# Altium schematic sheet 10-DPLL-1.SchDoc
size B; SheetNumber: 10; SheetTotal: 25
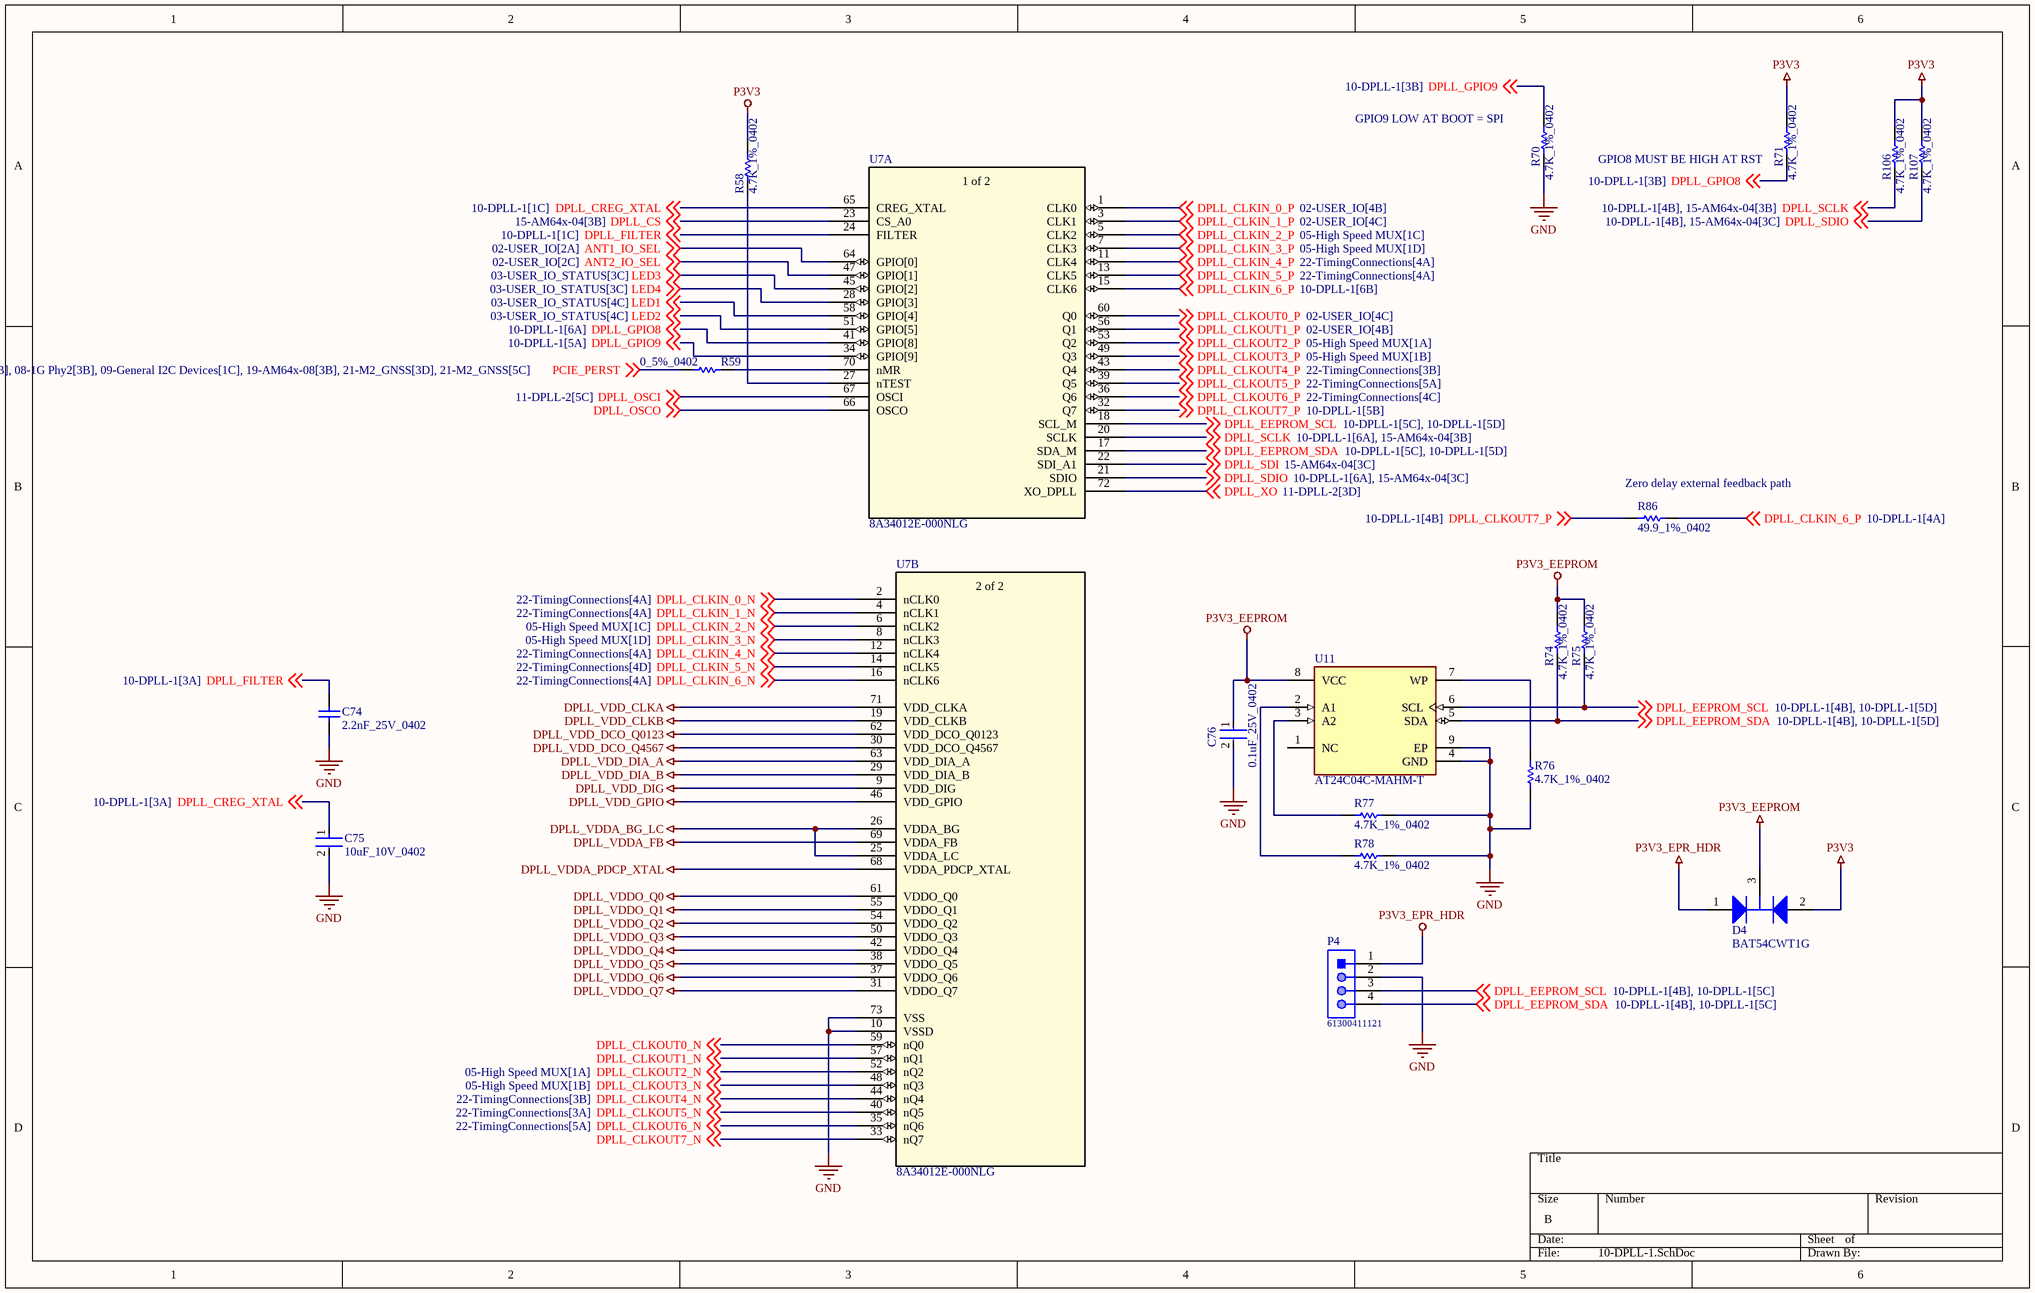
[diagram p0: 10-DPLL-1.SchDoc]

## Parts
C74  2.2nF_25V_0402  [CAPC1005X56X25LL10T15]
C75  10uF_10V_0402  [FP-CL05A106MP5NUNC-MFG]
C76  0.1uF_25V_0402  [FP-0402-L_1_0_1-W_0_5_0_1-IPC_C]
D4  BAT54CWT1G  [ONSC-SOT-323-3-419-04_V]
P4  61300411121  [61300411121]
R58  4.7K_1%_0402  [RESC1005X40X25NL10T10]
R59  0_5%_0402  [RESC1005X40X25LL10T10]
R70  4.7K_1%_0402  [RESC1005X40X25NL10T10]
R71  4.7K_1%_0402  [RESC1005X40X25NL10T10]
R74  4.7K_1%_0402  [RESC1005X40X25NL10T10]
R75  4.7K_1%_0402  [RESC1005X40X25NL10T10]
R76  4.7K_1%_0402  [RESC1005X40X25NL10T10]
R77  4.7K_1%_0402  [RESC1005X40X25NL10T10]
R78  4.7K_1%_0402  [RESC1005X40X25NL10T10]
R86  49.9_1%_0402  [RESC1005X40X25NL10T10]
R106  4.7K_1%_0402  [RESC1005X40X25NL10T10]
R107  4.7K_1%_0402  [RESC1005X40X25NL10T10]
U7  8A34012E-000NLG  [QFN_2E-000NLG_REN]  (parts A,B of 2)
U11  AT24C04C-MAHM-T  [FP-C04-21355-Q4B-IPC_B]

## Nets
DPLL_VDD_CLKA: U7.71(VDD_CLKA)
DPLL_VDD_CLKB: U7.19(VDD_CLKB)
DPLL_VDD_DCO_Q0123: U7.62(VDD_DCO_Q0123)
DPLL_VDD_DCO_Q4567: U7.30(VDD_DCO_Q4567)
DPLL_VDD_DIA_A: U7.63(VDD_DIA_A)
DPLL_VDD_DIA_B: U7.29(VDD_DIA_B)
DPLL_VDD_DIG: U7.9(VDD_DIG)
DPLL_VDD_GPIO: U7.46(VDD_GPIO)
DPLL_VDDA_BG_LC: U7.25(VDDA_LC) U7.26(VDDA_BG)
DPLL_VDDA_FB: U7.69(VDDA_FB)
DPLL_VDDA_PDCP_XTAL: U7.68(VDDA_PDCP_XTAL)
DPLL_VDDO_Q0: U7.61(VDDO_Q0)
DPLL_VDDO_Q1: U7.55(VDDO_Q1)
DPLL_VDDO_Q2: U7.54(VDDO_Q2)
DPLL_VDDO_Q3: U7.50(VDDO_Q3)
DPLL_VDDO_Q4: U7.42(VDDO_Q4)
DPLL_VDDO_Q5: U7.38(VDDO_Q5)
DPLL_VDDO_Q6: U7.37(VDDO_Q6)
DPLL_VDDO_Q7: U7.31(VDDO_Q7)
GND: C74.1 C75.2 C76.2 P4.2 R70.2 R76.2 R77.1 R78.2 U7.10(VSSD) U7.73(VSS) U11.4(GND) U11.9(EP)
P3V3: D4.2(A2) R58.2 R71.1 R106.1 R107.1
P3V3_EEPROM: C76.1 D4.3(K) R74.1 R75.1 U11.8(VCC)
P3V3_EPR_HDR: D4.1(A1) P4.1
ANT1_IO_SEL: U7.64(GPIO[0]) ; off-sheet ANT1_IO_SEL
ANT2_IO_SEL: U7.47(GPIO[1]) ; off-sheet ANT2_IO_SEL
DPLL_CLKIN_0_N: U7.2(nCLK0) ; off-sheet DPLL_CLKIN_0_N
DPLL_CLKIN_0_P: U7.1(CLK0) ; off-sheet DPLL_CLKIN_0_P
DPLL_CLKIN_1_N: U7.4(nCLK1) ; off-sheet DPLL_CLKIN_1_N
DPLL_CLKIN_1_P: U7.3(CLK1) ; off-sheet DPLL_CLKIN_1_P
DPLL_CLKIN_2_N: U7.6(nCLK2) ; off-sheet DPLL_CLKIN_2_N
DPLL_CLKIN_2_P: U7.5(CLK2) ; off-sheet DPLL_CLKIN_2_P
DPLL_CLKIN_3_N: U7.8(nCLK3) ; off-sheet DPLL_CLKIN_3_N
DPLL_CLKIN_3_P: U7.7(CLK3) ; off-sheet DPLL_CLKIN_3_P
DPLL_CLKIN_4_N: U7.12(nCLK4) ; off-sheet DPLL_CLKIN_4_N
DPLL_CLKIN_4_P: U7.11(CLK4) ; off-sheet DPLL_CLKIN_4_P
DPLL_CLKIN_5_N: U7.14(nCLK5) ; off-sheet DPLL_CLKIN_5_N
DPLL_CLKIN_5_P: U7.13(CLK5) ; off-sheet DPLL_CLKIN_5_P
DPLL_CLKIN_6_N: U7.16(nCLK6) ; off-sheet DPLL_CLKIN_6_N
DPLL_CLKIN_6_P: R86.2 U7.15(CLK6) ; off-sheet DPLL_CLKIN_6_P
DPLL_CLKOUT0_N: U7.59(nQ0) ; off-sheet DPLL_CLKOUT0_N
DPLL_CLKOUT0_P: U7.60(Q0) ; off-sheet DPLL_CLKOUT0_P
DPLL_CLKOUT1_N: U7.57(nQ1) ; off-sheet DPLL_CLKOUT1_N
DPLL_CLKOUT1_P: U7.56(Q1) ; off-sheet DPLL_CLKOUT1_P
DPLL_CLKOUT2_N: U7.52(nQ2) ; off-sheet DPLL_CLKOUT2_N
DPLL_CLKOUT2_P: U7.53(Q2) ; off-sheet DPLL_CLKOUT2_P
DPLL_CLKOUT3_N: U7.48(nQ3) ; off-sheet DPLL_CLKOUT3_N
DPLL_CLKOUT3_P: U7.49(Q3) ; off-sheet DPLL_CLKOUT3_P
DPLL_CLKOUT4_N: U7.44(nQ4) ; off-sheet DPLL_CLKOUT4_N
DPLL_CLKOUT4_P: U7.43(Q4) ; off-sheet DPLL_CLKOUT4_P
DPLL_CLKOUT5_N: U7.40(nQ5) ; off-sheet DPLL_CLKOUT5_N
DPLL_CLKOUT5_P: U7.39(Q5) ; off-sheet DPLL_CLKOUT5_P
DPLL_CLKOUT6_N: U7.35(nQ6) ; off-sheet DPLL_CLKOUT6_N
DPLL_CLKOUT6_P: U7.36(Q6) ; off-sheet DPLL_CLKOUT6_P
DPLL_CLKOUT7_N: U7.33(nQ7) ; off-sheet DPLL_CLKOUT7_N
DPLL_CLKOUT7_P: R86.1 U7.32(Q7) ; off-sheet DPLL_CLKOUT7_P
DPLL_CREG_XTAL: C75.1 U7.65(CREG_XTAL) ; off-sheet DPLL_CREG_XTAL
DPLL_CS: U7.23(CS_A0) ; off-sheet DPLL_CS
DPLL_EEPROM_SCL: P4.3 R75.2 U7.18(SCL_M) U11.6(SCL) ; off-sheet DPLL_EEPROM_SCL
DPLL_EEPROM_SDA: P4.4 R74.2 U7.17(SDA_M) U11.5(SDA) ; off-sheet DPLL_EEPROM_SDA
DPLL_FILTER: C74.2 U7.24(FILTER) ; off-sheet DPLL_FILTER
DPLL_GPIO8: R71.2 U7.41(GPIO[8]) ; off-sheet DPLL_GPIO8
DPLL_GPIO9: R70.1 U7.34(GPIO[9]) ; off-sheet DPLL_GPIO9
DPLL_OSCI: U7.67(OSCI) ; off-sheet DPLL_OSCI
DPLL_OSCO: U7.66(OSCO) ; off-sheet DPLL_OSCO
DPLL_SCLK: R106.2 U7.20(SCLK) ; off-sheet DPLL_SCLK
DPLL_SDI: U7.22(SDI_A1) ; off-sheet DPLL_SDI
DPLL_SDIO: R107.2 U7.21(SDIO) ; off-sheet DPLL_SDIO
DPLL_XO: U7.72(XO_DPLL) ; off-sheet DPLL_XO
LED1: U7.58(GPIO[4]) ; off-sheet LED1
LED2: U7.51(GPIO[5]) ; off-sheet LED2
LED3: U7.45(GPIO[2]) ; off-sheet LED3
LED4: U7.28(GPIO[3]) ; off-sheet LED4
PCIE_PERST: R59.1 ; off-sheet PCIE_PERST
NetR58_1: R58.1 U7.27(nTEST)
NetR59_2: R59.2 U7.70(nMR)
NetR76_1: R76.1 U11.7(WP)
NetR77_2: R77.2 U11.3(A2)
NetR78_1: R78.1 U11.2(A1)

Not connected (* = marked no-connect by the designer): U11 1(NC)

## Notes on the sheet
- (near R70) GPIO9 LOW AT BOOT = SPI
- GPIO8 MUST BE HIGH AT RST
- (near R86) Zero delay external feedback path
- (in symbol 8A34002E-000NLG, part A) 1 of 2
- (in symbol 8A34002E-000NLG, part B) 2 of 2

## Library data of the parts
C74 = CMP-2008-02907-1: Manufacturer: AVX Interconnect / Elco; Part Number: 04025C222JAT2A
C75 = CMP-13271-000002-1: CAP CER 10UF 10V X5R 0402; Manufacturer Part Number: CL05A106MP5NUNC; Manufacturer: Samsung; Temperature Coefficient: 15%; Tolerance: 20%; Material: Ceramic; Octopart: https://octopart.com/cl05a106mp5nunc-samsung-22457395; Voltage Rating: 10V; RoHS: TRUE; Value: 10uF; Height: 0.7mm; Digikey Description: CAP CER 10UF 10V X5R 0402; Automotive: No; Package: CL05A106MP5NUNC; Device Class L1: Passive Components; Capacitance: 10uF; Temperature Range High: +85°C; ComponentLink2Description: Datasheet; Device Class L2: Capacitors; Temperature Characteristic: X5R; Temperature: -55°C to +85°C; ComponentLink2URL: http://www.samsungsem.com/kr/support/product-search/mlcc/__icsFiles/afieldfile/2019/05/10/19-CL05A106MP5NUNC.pdf; Device Class L3: Ceramic Capacitors; Category: Cap; Temperature Range Low: -55°C; Ipc Land Pattern Name: CAPC10050X50; Lead Free: Yes
C76 = CMP-2008-02519-2: General Purpose Ceramic Capacitor, 0402, 100nF, 10%, X7R, 15%, 25V; Package Quantity: 1; Capacitance: 100nF; Min Operating Temperature: -55°C; Voltage: 25V; Voltage Rating: 25V; Construction: Flat; Max Operating Temperature: 125°C; Radiation Hardening: No; Depth: 0.5mm; Thickness: 0.022inch; Voltage Rating (DC): 25V; Number of Pins: 2; Lead Free: Lead Free; Series: -; REACH SVHC: No SVHC; Length: 1mm; Dielectric: X7R; RoHS Compliant: Yes; Mount: Surface Mount; Packaging: Tape and Reel; Case/Package: 0402; Case Code (Imperial): 0402; Termination: SMD/SMT; Width: 0.02inch; Case Code (Metric): 1005; Tolerance: 10%
D4 = CMP-1055-00557-1: Dual Series Cathode Schottky Barrier Diodes, 3-Pin SOT-323, Pb-Free, Tape and Reel; Manufacturer: On Semiconductor; Configuration: Common Cathode; IFSM Max (A): 0.6; trr Max (ns): 5; ComponentLink2Description: Datasheet; Packing: Tape and Reel; ComponentLink3Description: Package Specification; Mounting Technology: Surface Mount; PartNumber: BAT54CWT1G; PackageVersion: Rev. N, 11/2008; RoHS: TRUE; ComponentLink3URL: http://www.onsemi.com/pub_link/Collateral/419-04.PDF; ComponentLink2URL: http://www.onsemi.cn/pub_link/Collateral/BAT54CWT1-D.PDF; PackageReference: SOT-323-3-419-04; ComponentLink1URL: http://www.onsemi.com/; ComponentLink1Description: Manufacturer URL; DatasheetVersion: Rev. 7; PackageDescription: 3-Pin Small Outline Transistor, Body 2 x 1.25 mm, Pitch 0.65 mm
P4 = CMP-1502-01064-1: THT Vertical Pin Header WR-PHD, Pitch 2.54 mm, Single Row, 4 pins; Manufacturer: Wurth Elektronik; Withstanding Voltage: 500VAC; Rated Current: 3A; Working Voltage: 250VAC; Pin Number: 4; Gender: Male; Contact Resistance: 20mOhm; Pitch: 2.54mm; Manufacturer URL: http://www.we-online.de; Operating Temperature: -40to105degC; Packaging: Bag; Mounting Technology: THT; Package Reference: 61300411121; Datasheet URL: https://katalog.we-online.de/em/datasheet/6130xx11121.pdf; Publisher: WurthElektronik; Part Number: 61300411121; Row Number: Single; Orientation: Vertical
R58 R70 R71 R74-R78 R106 R107 = CMP-2002-05217-1: Manufacturer: Bourns; Part Number: CR0402-FX-4701GLF
R59 = CMP-2002-04569-1: Manufacturer: KOA Speer; Part Number: RK73Z1ETTP
R86 = CMP-2002-04448-1: Part Number: RK73H1ETTP49R9F; Manufacturer: KOA Speer
U7 = 8A34002E-000NLG: No Description Available; Mfr_Name: Renesas Electronics; RefDes: RefDes; Type: Type
U11 = CMP-06313-000185-1: IC EEPROM 4KBIT I2C 1MHZ 8UDFN; Write Protection: YES; Max Frequency: 400kHz; Access Time: 900ns; Supply Current: 3mA; Density: 4Kb; Min Supply Voltage: 1.7V; Organization: 512X8; Max Supply Voltage: 5.5V; Number of Pins: 8; Series: -; Memory Type: EEPROM; Radiation Hardening: No; RoHS Compliant: Yes; Packaging: Tape and Reel; Interface: I2C; Min Operating Temperature: -40°C; Contact Plating: Gold; Mount: Surface Mount; Package Quantity: 5000; Nominal Supply Current: 3mA; Access Time-Max: 900ns; Max Operating Temperature: 85°C; Frequency: 400kHz